# EAGLE design pclone-control (EAGLE 6.6.0)
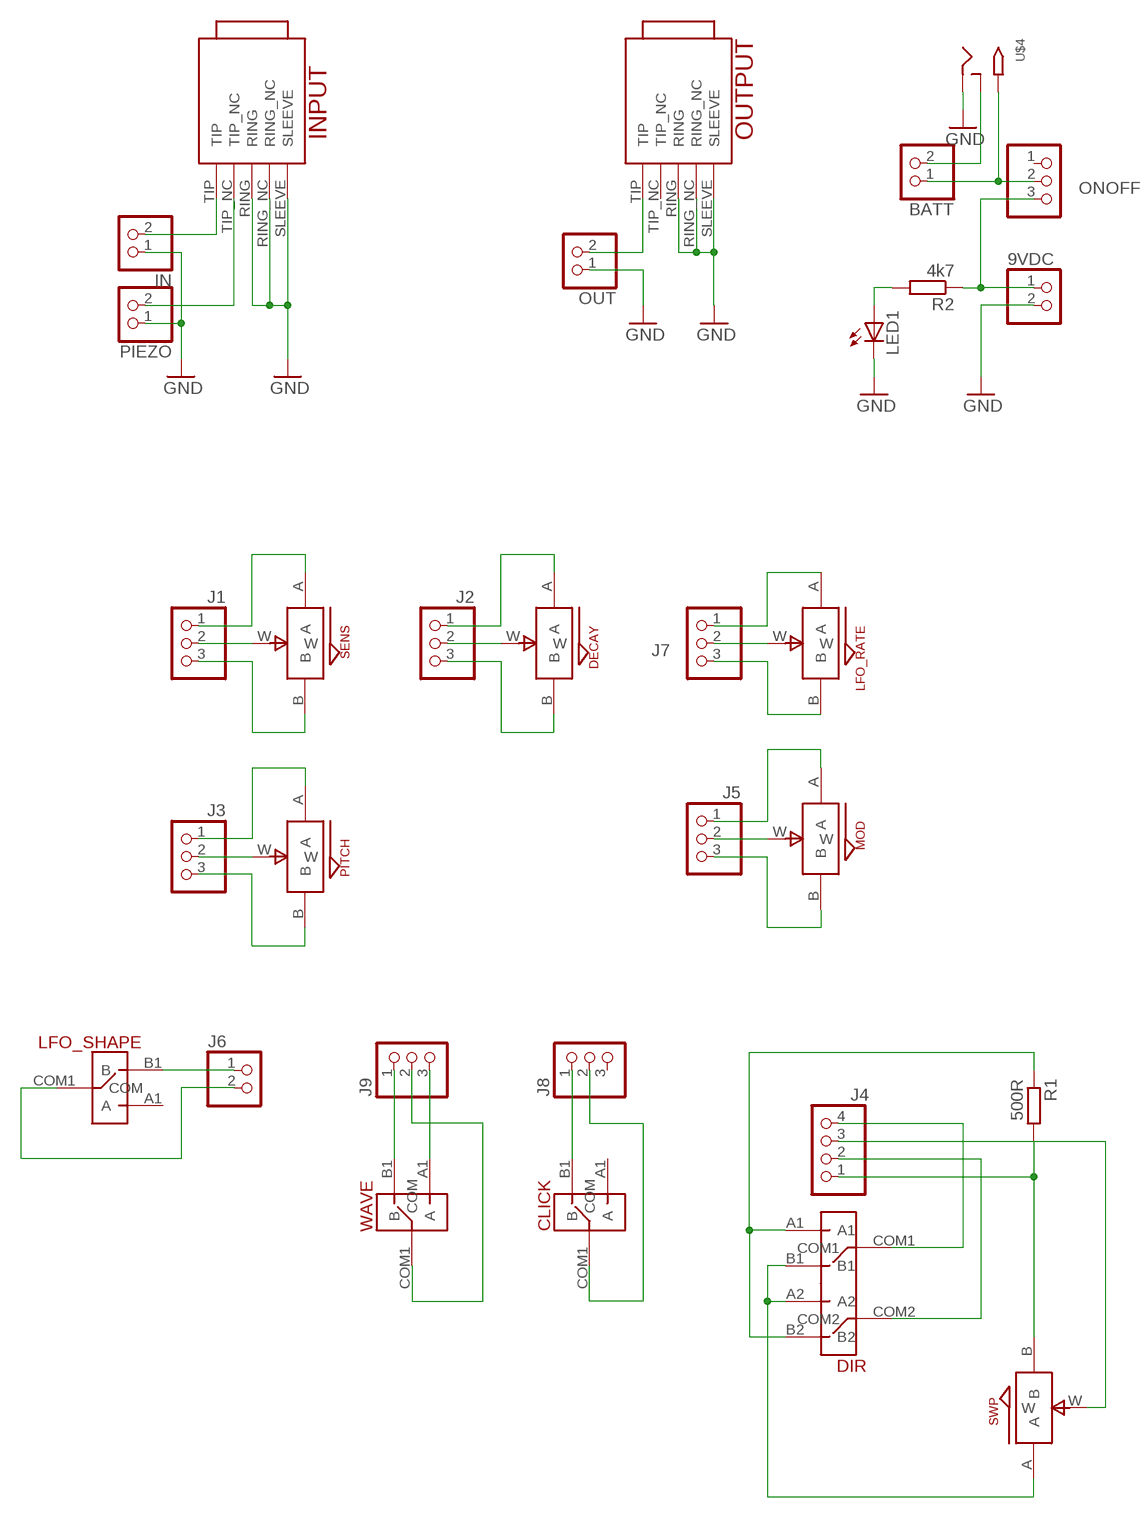
[diagram p0: schematic, sheet 1]

## Parts
9VDC  PINHD-1X2  [1X02]
BATT  PINHD-1X2  [1X02]
CLICK  SPDT_SW  [SPDT_SW]
DECAY  ALPS_POT_SMALL  [SMALL_ALPS_POT]
DIR  DPDT_SW  [DPDT_SW]
IN  PINHD-1X2  [1X02]
INPUT  TRUCONNECTJACK  [TRUCONNECTJACK]
J1  PINHD-1X3  [1X03]
J2  PINHD-1X3  [1X03]
J3  PINHD-1X3  [1X03]
J4  PINHD-1X4  [1X04]
J5  PINHD-1X3  [1X03]
J6  PINHD-1X2  [1X02]
J7  PINHD-1X3  [1X03]
J8  PINHD-1X3  [1X03]
J9  PINHD-1X3  [1X03]
LED1  LED3MM  [LED3MM]
LFO_RATE  ALPS_POT_SMALL  [SMALL_ALPS_POT]
LFO_SHAPE  SPDT_SW  [SPDT_SW]
MOD  ALPS_POT_SMALL  [SMALL_ALPS_POT]
ONOFF  PINHD-1X3  [1X03]
OUT  PINHD-1X2  [1X02]
OUTPUT  TRUCONNECTJACK  [TRUCONNECTJACK]
PIEZO  PINHD-1X2  [1X02]
PITCH  ALPS_POT_SMALL  [SMALL_ALPS_POT]
R1  500R  R-EU_0207/7  [0207/7]
R2  4k7  R-EU_0207/7  [0207/7]
SENS  ALPS_POT_SMALL  [SMALL_ALPS_POT]
SWP  ALPS_POT_SMALL  [SMALL_ALPS_POT]
U$4  2.1MMJACKTHM  [PJ-102A]
WAVE  SPDT_SW  [SPDT_SW]

## Nets
GND: 9VDC.2 IN.1 INPUT.RING INPUT.RING_NC INPUT.SLEEVE J1.1 LED1.K(C) OUT.1 OUTPUT.RING OUTPUT.RING_NC OUTPUT.SLEEVE PIEZO.1 SENS.A U$4.RING
N$1: J4.1 R1.2 SWP.B
N$2: DIR.A1 DIR.B2 R1.1
N$3: DIR.A2 DIR.B1 SWP.A
N$4: DIR.COM1 J4.4
N$5: DIR.COM2 J4.2
N$6: J4.3 SWP.W
N$7: J9.1 WAVE.B1(B)
N$8: J9.3 WAVE.A1(A)
N$9: J9.2 WAVE.COM1(COM)
N$10: CLICK.B1(B) J8.1
N$11: CLICK.COM1(COM) J8.2
N$12: J6.1 LFO_SHAPE.B1(B)
N$13: J6.2 LFO_SHAPE.COM1(COM)
N$14: J1.2 SENS.W
N$15: BATT.1 ONOFF.2 U$4.TIP
N$16: J1.3 SENS.B
N$17: DECAY.W J2.2
N$18: DECAY.A J2.1
N$19: DECAY.B J2.3
N$20: J5.2 MOD.W
N$21: J5.1 MOD.A
N$22: J5.3 MOD.B
N$23: J3.2 PITCH.W
N$24: J3.1 PITCH.A
N$25: J3.3 PITCH.B
N$26: J7.2 LFO_RATE.W
N$27: J7.3 LFO_RATE.B
N$28: J7.1 LFO_RATE.A
N$29: BATT.2 U$4.RING_SW
N$30: 9VDC.1 ONOFF.3 R2.1
N$31: LED1.A R2.2
N$32: OUT.2 OUTPUT.TIP
N$33: INPUT.TIP_NC PIEZO.2
N$34: IN.2 INPUT.TIP
Unconnected: CLICK.A1(A) J8.3 LFO_SHAPE.A1(A) ONOFF.1 OUTPUT.TIP_NC

## Library data of the parts
9VDC BATT IN J6 OUT PIEZO = pinhead:PINHD-1X2: PIN HEADER
CLICK LFO_SHAPE WAVE = jason_eagle6:SPDT_SW
DECAY LFO_RATE MOD PITCH SENS SWP = jasons_stuff:ALPS_POT_SMALL
DIR = jason_eagle6:DPDT_SW
INPUT OUTPUT = jason_eagle6:TRUCONNECTJACK
J1-J3 J5 J7-J9 ONOFF = pinhead:PINHD-1X3: PIN HEADER
J4 = pinhead:PINHD-1X4: PIN HEADER
LED1 = led:LED: LED OSRAM: - CHIPLED LG R971, LG N971, LY N971, LG Q971, LY Q971, LO R971, LY R971 LH N974, LH R974 LS Q976, LO Q976, LY Q976 LO Q996 - Hyper CHIPLED LW Q18S LB Q993, LB Q99A, LB R99A - SideLED LS A670, LO A670, LY A670, LG A670, LP A670 LB A673, LV A673, LT A673, LW A673 LH A674 LY A675 LS A676, LA A676, LO A676, LY A676, LW A676 LS A679, LY A679, LG A679 - Hyper Micro SIDELED® LS Y876, LA Y876, LO Y876, LY Y876 LT Y87S - SmartLED LW L88C, LW L88S LB L89C, LB L89S, LG L890 LS L89K, LO L89K, LY L89K LS L896, LA L896, LO L896, LY L896 - TOPLED LS T670, LO T670, LY T670, LG T670, LP T670 LSG T670, LSP T670, LSY T670, LOP T670, LYG T670 LG T671, LOG T671, LSG T671 LB T673, LV T673, LT T673, LW T673 LH T674 LS T676, LA T676, LO T676, LY T676, LB T676, LH T676, LSB T676, LW T676 LB T67C, LV T67C, LT T67C, LS T67K, LO T67K, LY T67K, LW E67C LS E67B, LA E67B, LO E67B, LY E67B, LB E67C, LV E67C, LT E67C LW T67C LS T679, LY T679, LG T679 LS T770, LO T770, LY T770, LG T770, LP T770 LB T773, LV T773, LT T773, LW T773 LH T774 LS E675, LA E675, LY E675, LS T675 LS T776, LA T776, LO T776, LY T776, LB T776 LHGB T686 LT T68C, LB T68C - Hyper Mini TOPLED® LB M676 - Mini TOPLED Santana® LG M470 LS M47K, LO M47K, LY M47K Source: http://www.osram.convergy.de LUXEON: - LUMILED® LXK2-PW12-R00, LXK2-PW12-S00, LXK2-PW14-U00, LXK2-PW14-V00 LXK2-PM12-R00, LXK2-PM12-S00, LXK2-PM14-U00 LXK2-PE12-Q00, LXK2-PE12-R00, LXK2-PE12-S00, LXK2-PE14-T00, LXK2-PE14-U00 LXK2-PB12-K00, LXK2-PB12-L00, LXK2-PB12-M00, LXK2-PB14-N00, LXK2-PB14-P00, LXK2-PB14-Q00 LXK2-PR12-L00, LXK2-PR12-M00, LXK2-PR14-Q00, LXK2-PR14-R00 LXK2-PD12-Q00, LXK2-PD12-R00, LXK2-PD12-S00 LXK2-PH12-R00, LXK2-PH12-S00 LXK2-PL12-P00, LXK2-PL12-Q00, LXK2-PL12-R00 Source: www.luxeon.com KINGBRIGHT: KA-3528ASYC Source: www.kingbright.com
R1 R2 = rcl:R-EU_: RESISTOR, European symbol
U$4 = adafruit:2.1MMJACK: 2.1mm x 5.5mm THM DC jack with internal switch. Digikey part #PJ-102A, 4UCON part #05537 2.1mm x 5.5mm SMT DC jack with internal switch. Digikey part #PJ-002A-SMT, 4UCON part #03267 By microbuilder.eu & adafruit.com

## Board
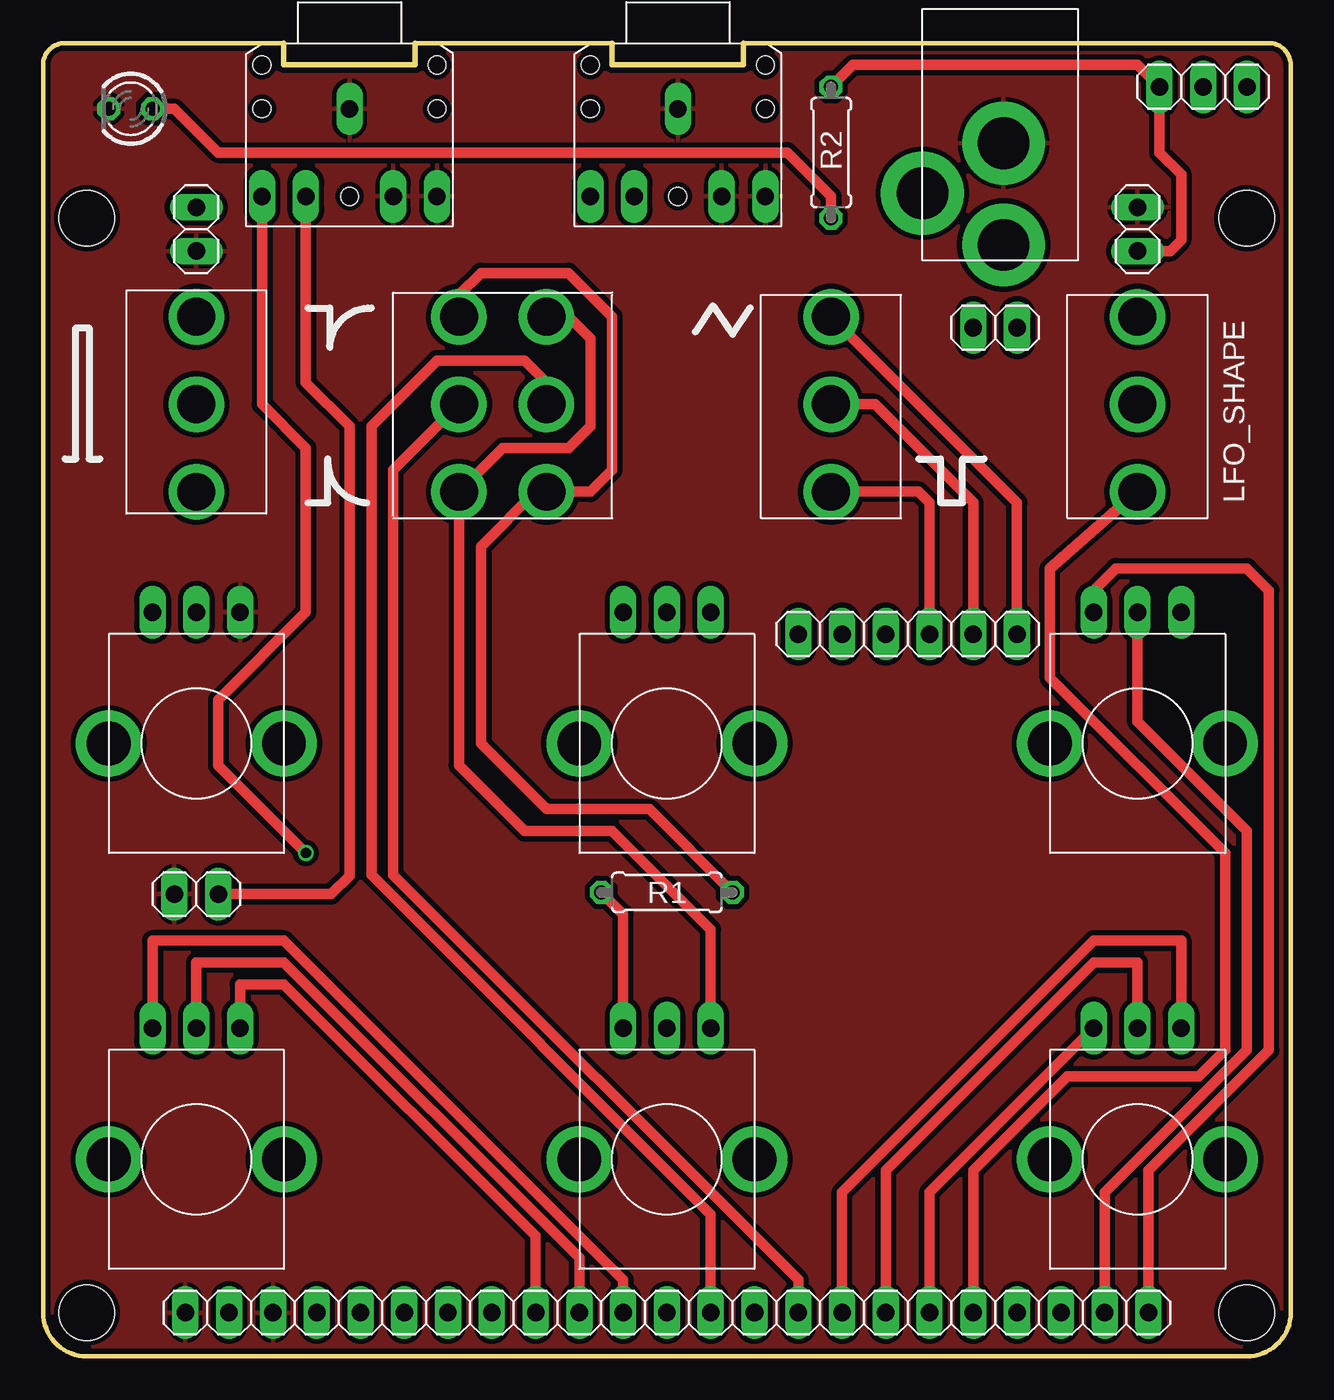
[diagram p1: board, top side]
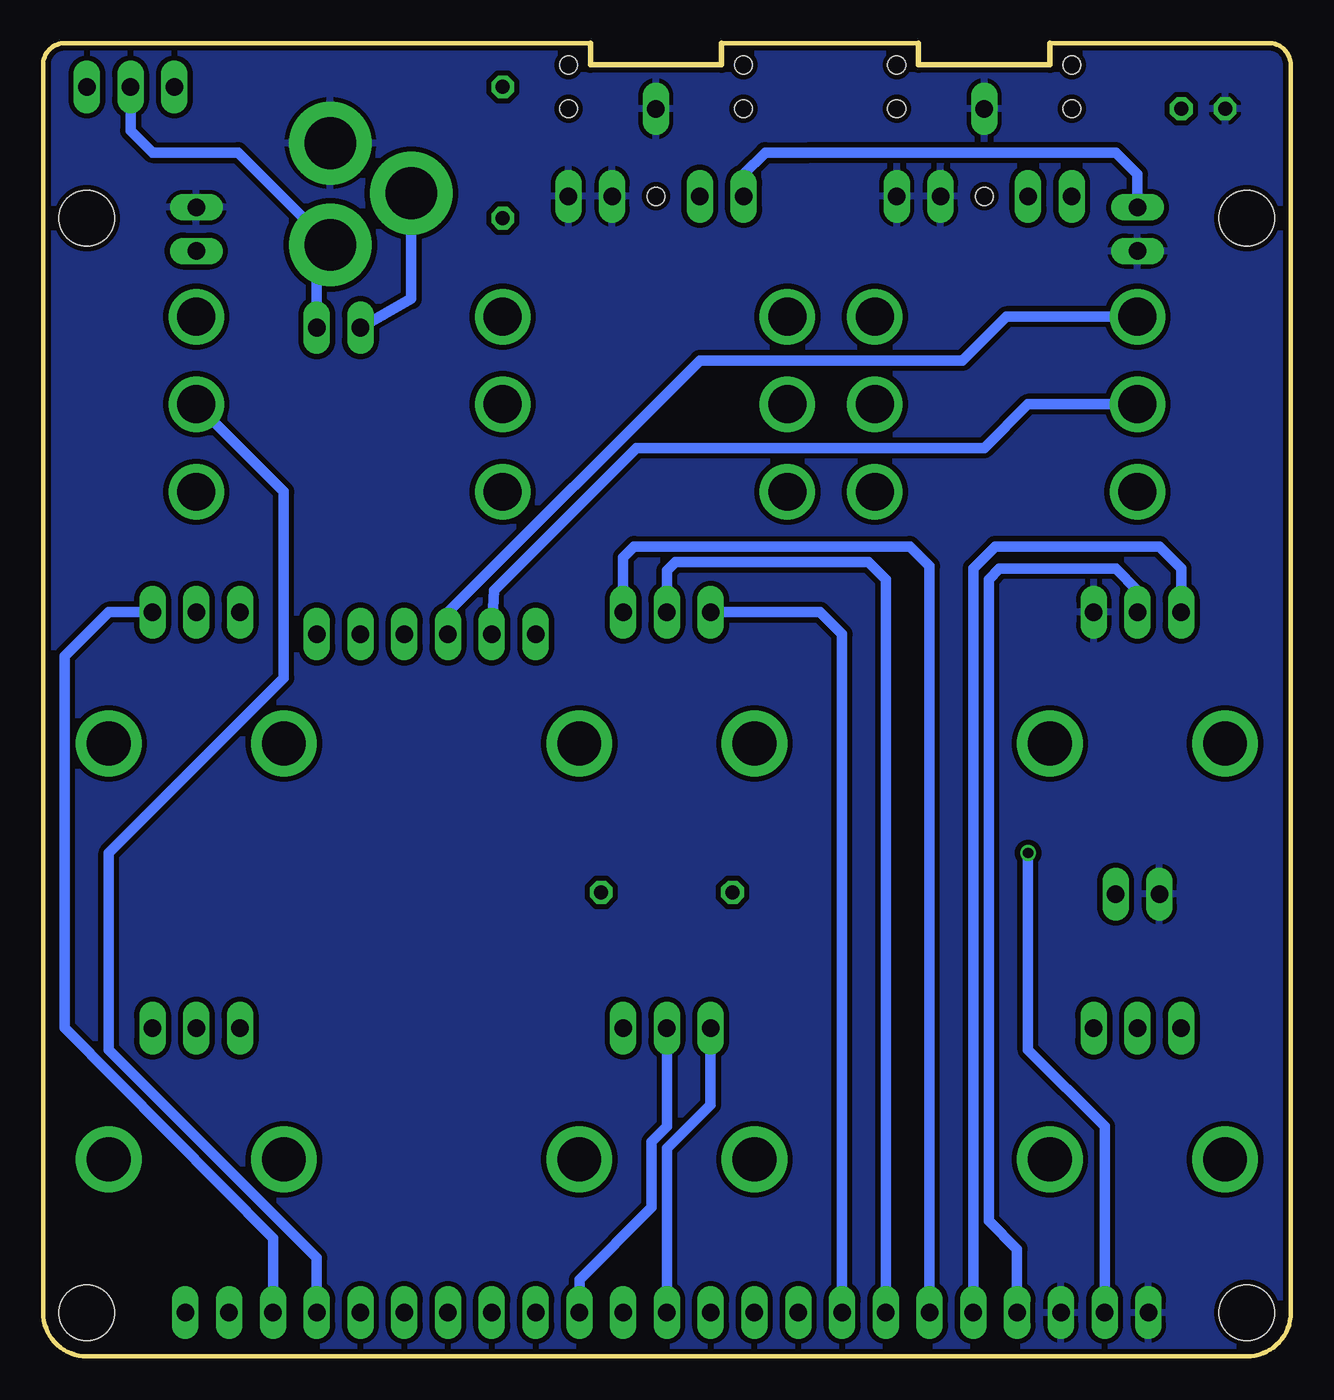
[diagram p2: board, bottom side, seen from below]

Size 72.39 x 76.2 mm. Coordinates in mm from the lower left corner, seen from the top.
Outline: 1.27,76.2 13.97,76.2 13.97,74.93 21.59,74.93 21.59,76.2 33.02,76.2 33.02,74.93 40.64,74.93 40.64,76.2 71.12,76.2 arc-90 72.39,74.93 72.39,2.54 arc-90 69.85,0 2.54,0 arc-90 0,2.54 0,74.93 arc-90 1.27,76.2
Copper layers (1*16): Top 0.035mm / dielectric 1.5mm / Bottom 0.035mm
Design rules "ITEADstudio_DRC": minimum track width 6mil, minimum drill 12mil, track to track 6mil, track to pad 6mil, pad to pad 6mil, via to via 6mil, smd to smd 0mil, copper to edge 10mil, drill to drill 10mil, minimum pad ring 10mil, minimum via ring 6mil, stop-mask expansion 2mil, vias tented up to drill 100mil, thermal gap 10mil
Holes 3.2 mm at 69.85,66.04 69.85,2.54 2.54,2.54 2.54,66.04

### Footprints (pad centres in the part's own frame; a part is rotated, then mirrored left to right if it is on the bottom)
1X02 = drill 1.016 long: 1 -1.27,0; 2 1.27,0
SPDT_SW = drill 2.2: A1 0,5.08; B1 0,-5.08; COM1 0,0
SMALL_ALPS_POT = drill 1.016 long: A -2.54,-7.62; B 2.54,-7.62; W 0,-7.62 | drill 2.54 pad 3.81: GND@1 -5.08,0; GND@2 5.08,0
DPDT_SW = drill 2.2: A1 -2.54,5.08; A2 2.54,5.08; B1 -2.54,-5.08; B2 2.54,-5.08; COM1 -2.54,0; COM2 2.54,0
TRUCONNECTJACK = drill 1.016 long: RING -1.27,-5.08; RING_NC -1.27,-2.54; SLEEVE 3.81,0; TIP -1.27,5.08; TIP_NC -1.27,2.54 | hole 1.016: 3.81,5.08; 6.35,5.08; 3.81,-5.08; 6.35,-5.08; -1.27,0
1X03 = drill 1.016 long: 1 -2.54,0; 2 0,0; 3 2.54,0
1X04 = drill 1.016 long: 1 -3.81,0; 2 -1.27,0; 3 1.27,0; 4 3.81,0
LED3MM = drill 0.813 octagon: A -1.27,0; K 1.27,0
0207/7 = drill 0.813 octagon: 1 -3.81,0; 2 3.81,0
PJ-102A = drill 3 pad 4.8: RING 0.1,-3.39; RING_SW -4.6,-6.29; TIP 0.1,-9.29

### Placement (x,y rotation side)
9VDC  63.5,65.41 90 top
BATT  55.25,59.69 180 top
CLICK  8.89,55.24 180 top
DECAY  36.2,35.56 180 top
DIR  26.67,55.24 0 top
IN  9.52,2.54 0 top
INPUT  17.78,68.58 90 top
J1  15.88,2.54 0 top
J2  23.49,2.54 0 top
J3  31.12,2.54 0 top
J4  40.01,2.54 0 top
J5  48.89,2.54 0 top
J6  55.25,2.54 0 top
J7  61.59,2.54 0 top
J8  46.35,41.91 180 top
J9  53.98,41.91 0 top
LED1  5.08,72.39 180 top
LFO_RATE  63.5,35.56 180 top
LFO_SHAPE  63.5,55.24 0 top
MOD  63.5,11.43 180 top
ONOFF  67.31,73.66 180 top
OUT  8.89,65.41 90 top
OUTPUT  36.83,68.58 90 top
PIEZO  8.89,26.82 0 top
PITCH  8.89,11.43 180 top
R1  36.2,26.92 180 top
R2  45.72,69.85 270 top
SENS  8.89,35.56 180 top
SWP  36.2,11.43 180 top
U$4  55.63,73.79 0 top
WAVE  45.72,55.24 0 top

### Tracks (layer width: path | path; a pad name or v marks a point on that pad's centre or on a via)
GND
  pour Bottom (isolate 0.305): -1.27,76.2 73.66,76.2 73.66,-1.27 -1.27,-1.27
  pour Top (isolate 0.305): -1.27,76.2 -1.27,0 73.66,0 73.66,76.2
N$1
  Top 0.61: SWP.B 33.66,25.65 R1.2
  Bottom 0.61: SWP.B 33.66,14.61 36.2,12.07 J4.1
N$2
  Top 0.61: DIR.A1 24.13,61.59 25.4,62.87 30.48,62.87 33.02,60.32 33.02,51.43 31.75,50.16 DIR.B2 28.58,50.16 25.4,46.99 25.4,35.56 29.21,31.75 35.18,31.75 R1.1
N$3
  Top 0.61: DIR.A2 30.48,60.32 31.75,59.05 31.75,53.97 30.48,52.7 26.67,52.7 DIR.B1 24.13,34.29 27.94,30.48 33.02,30.48 38.73,24.77 SWP.A
N$4
  Top 0.61: J4.4 43.81,4.45 20.32,27.94 20.32,51.43 DIR.COM1
N$5
  Top 0.61: J4.2 38.73,8.26 19.05,27.94 19.05,53.97 22.86,57.78 27.94,57.78 29.21,56.51 DIR.COM2
N$6
  Bottom 0.61: SWP.W 36.2,13.34 37.08,12.45 37.08,8.64 41.27,4.45 J4.3
N$7
  Top 0.61: J9.1 51.44,49.53 50.8,50.16 WAVE.B1
N$8
  Top 0.61: WAVE.A1 56.52,49.53 J9.3
N$9
  Top 0.61: J9.2 53.98,49.53 48.26,55.24 WAVE.COM1
N$10
  Bottom 0.61: CLICK.B1 16.51,60.32 19.05,57.78 34.29,57.78 48.89,43.18 J8.1
N$11
  Bottom 0.61: CLICK.COM1 15.24,55.24 17.78,52.7 37.97,52.7 46.23,44.45 J8.2
N$12
  Top 0.61: LFO_SHAPE.B1 58.42,45.72 58.42,39.37 68.58,29.21 68.58,17.78 67.06,16.26 59.44,16.26 53.98,10.79 J6.1
N$13
  Bottom 0.61: J6.2 56.52,5.71 68.58,17.78 68.58,29.21 58.42,39.37 58.42,50.16 LFO_SHAPE.COM1
N$14
  Bottom 0.61: J1.2 15.88,6.22 17.53,7.87 17.53,45.08 16.89,45.72 10.16,45.72 8.89,44.45 SENS.W
N$15
  Bottom 0.61: ONOFF.2 67.31,71.12 66.04,69.85 61.08,69.85 U$4.TIP 56.52,63.71 BATT.1
N$16
  Bottom 0.61: J1.3 18.41,45.72 17.14,46.99 7.62,46.99 6.35,45.72 SENS.B
N$17
  Bottom 0.61: J2.2 23.49,45.08 24.51,46.1 35.69,46.1 36.2,45.59 DECAY.W
N$18
  Bottom 0.61: J2.1 20.95,45.85 22.1,46.99 38.1,46.99 38.73,46.35 DECAY.A
N$19
  Bottom 0.61: J2.3 26.03,41.91 27.3,43.18 DECAY.B
N$20
  Top 0.61: J5.2 48.89,10.79 60.96,22.86 63.5,22.86 MOD.W
N$21
  Top 0.61: J5.1 46.35,9.53 60.96,24.13 66.04,24.13 MOD.A
N$22
  Top 0.61: J5.3 51.44,9.53 MOD.B
N$23
  Top 0.61: J3.2 31.12,5.71 13.97,22.86 8.89,22.86 PITCH.W
N$24
  Top 0.61: J3.1 28.58,6.99 13.97,21.59 11.43,21.59 PITCH.A
N$25
  Top 0.61: J3.3 33.66,4.45 13.97,24.13 6.35,24.13 PITCH.B
N$26
  Top 0.61: J7.2 61.59,9.53 69.85,17.78 69.85,30.48 63.5,36.83 LFO_RATE.W
N$27
  Top 0.61: J7.3 64.14,10.79 71.12,17.78 71.12,44.45 69.85,45.72 62.23,45.72 60.96,44.45 LFO_RATE.B
N$28
  Bottom 0.61: J7.1 59.05,6.86 71.12,19.05 71.12,40.64 68.58,43.18 LFO_RATE.A
N$29
  Bottom 0.61: U$4.RING_SW 51.03,61.37 BATT.2
N$30
  Top 0.61: R2.1 46.99,74.93 63.5,74.93 ONOFF.3 64.77,69.85 66.04,68.58 66.04,64.77 65.41,64.14 9VDC.1
N$31
  Top 0.61: LED1.A 7.62,72.39 10.16,69.85 43.18,69.85 45.72,67.31 R2.2
N$32
  Bottom 0.61: OUT.2 8.89,68.58 10.16,69.85 26.67,69.85 27.94,69.85 30.48,69.85 31.75,68.58 OUTPUT.TIP
N$33
  Top 0.61: INPUT.TIP_NC 15.24,56.51 17.78,53.97 17.78,27.89 16.71,26.82 PIEZO.2
N$34  (via drill 0.6)
  Top 0.61: INPUT.TIP 12.7,55.24 15.24,52.7 15.24,43.18 10.16,38.1 10.16,34.29 v15.24,29.21
  Bottom 0.61: IN.2 10.79,13.34 15.24,17.78 v15.24,29.21